# Altium schematic sheet Schematic.SchDoc
size A; SheetNumber: 1; SheetTotal: 1
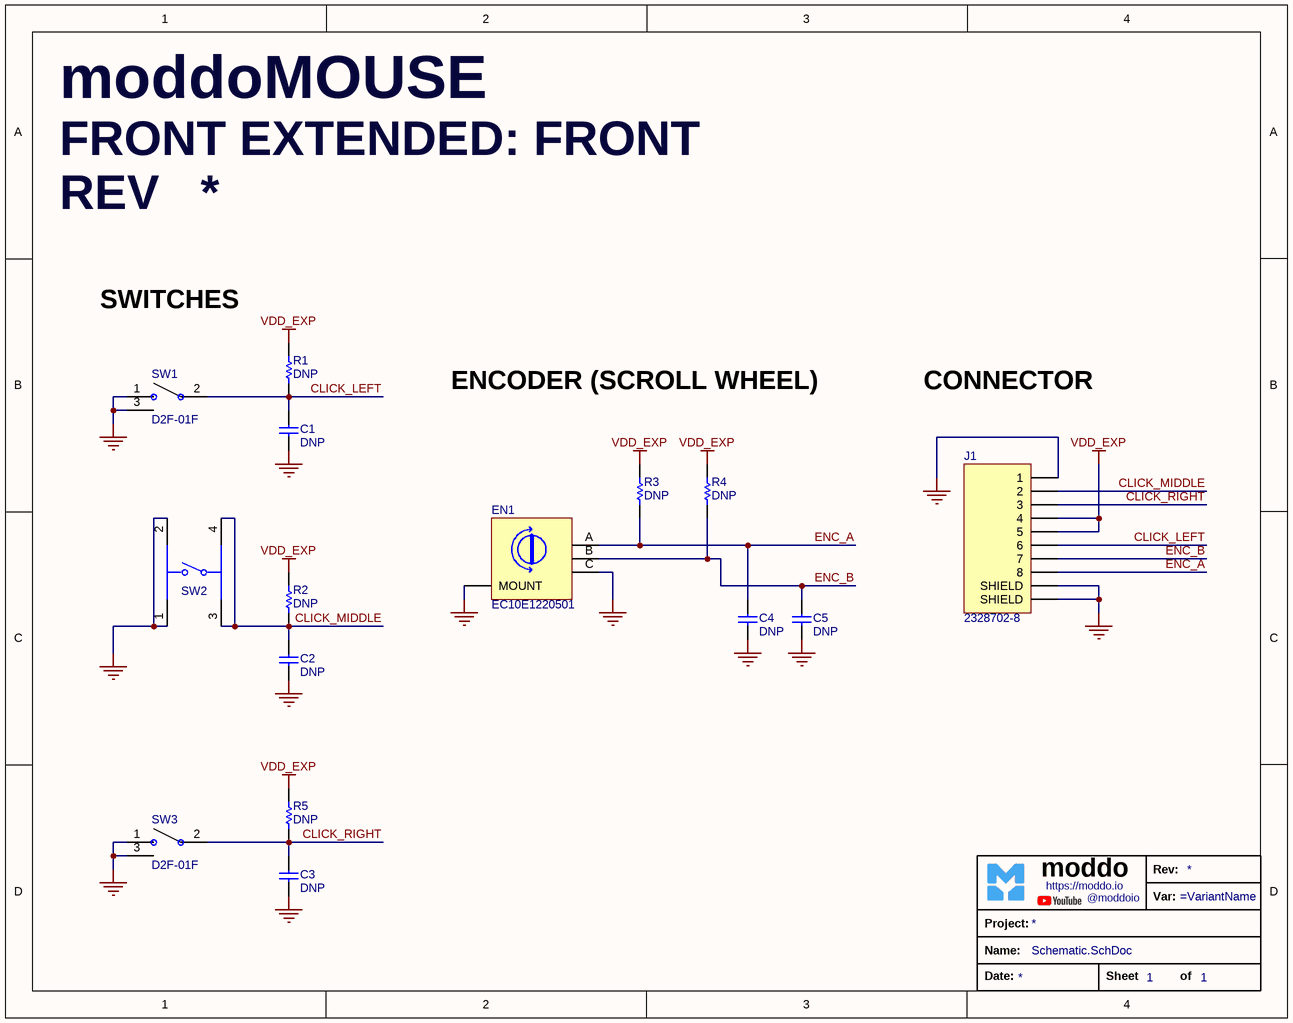
[diagram p0: Schematic.SchDoc]

## Parts
?  TitleBlock_moddo  (value not drawn)  (graphical)
C1  value DNP  [CAP0603]  (hidden comment: N/A)
C2  value DNP  [CAP0603]  (hidden comment: N/A)
C3  value DNP  [CAP0603]  (hidden comment: N/A)
C4  value DNP  [CAP0603]  (hidden comment: N/A)
C5  value DNP  [CAP0603]  (hidden comment: N/A)
EN1  EC10E1220501  [THROUGH_SHAFT_ENCODER_9MM]
J1  2328702-8  [2328702-8]
R1  value DNP  [RES0603]  (hidden comment: N/A)
R2  value DNP  [RES0603]  (hidden comment: N/A)
R3  value DNP  [RES0603]  (hidden comment: N/A)
R4  value DNP  [RES0603]  (hidden comment: N/A)
R5  value DNP  [RES0603]  (hidden comment: N/A)
SW1  D2F-01F  [Microswitch]
SW2  TS02-66-70-BK-100-SCR-D  [TS02-66-70-BK-100-SCR-D]  (value not drawn)
SW3  D2F-01F  [Microswitch]

## Nets
GND: C1.1 C2.1 C3.1 C4.1 C5.1 EN1.C EN1.MOUNT J1.1 J1.S1(SHIELD) J1.S2(SHIELD) SW1.1 SW1.3 SW2.1 SW2.2 SW3.1 SW3.3
VDD_EXP: J1.4 J1.5 R1.1 R2.1 R3.1 R4.1 R5.1
CLICK_LEFT: C1.2 J1.6 R1.2 SW1.2
CLICK_MIDDLE: C2.2 J1.2 R2.2 SW2.3 SW2.4
CLICK_RIGHT: C3.2 J1.3 R5.2 SW3.2
ENC_A: C4.2 EN1.A J1.8 R3.2
ENC_B: C5.2 EN1.B J1.7 R4.2

## Notes on the sheet
- moddoMOUSE
- FRONT EXTENDED: FRONT
- REV
- SWITCHES
- ENCODER (SCROLL WHEEL)
- CONNECTOR
- (in symbol TitleBlock_moddo) Rev:; moddo; https://moddo.io; Var:; @moddoio; Project:; Name:; Date:; Sheet; of

## Library data of the parts
C1-C5 = C0402-1µ0: Manufacturer: N/A; Manufacturer Part Number: N/A; RoHS: Yes; Category: Ceramic Capacitors; RoHS Compliant: Yes
EN1 = EC10E1220501: Mechanical Encoder Rotary Incremental Hollow 5mN.m Right Angle Quadrature Digital Square Wave 12PPR Through Hole PC Pin; Manufacturer: Alps Electric; Number of Channels: 2; Max Supply Voltage (DC): 5V; Pulses per Revolution: 12; Built in Switch: No; Hole Diameter: 1.8mm; Supplier 1: Newark; Manufacturer Part Number: EC10E1220501; RoHS: Yes; Category: Encoders; Stock 1: 3368; Pricing 1: 1=1.08, 10=0.867, 25=0.832, 50=0.798, 100=0.762 (USD); Mounting Technology: Through Hole; Pins: 3; Min Operating Temperature: -30°C; Max Operating Temperature: 85°C; Packaging: Bulk; Package Quantity: 1600; Termination: Through Hole; Radiation Hardening: No; Lead Free: Lead Free; RoHS Compliant: Yes; ComponentLink1URL: https://datasheet.ciiva.com/16205/ec10e-16205171.pdf?src-supplier=Onlinecomponents.com; ComponentLink1Description: https://datasheet.ciiva.com/16205/ec10e-16205171.pdf?src-supplier=Onlinecomponents.com; ComponentLink2URL: https://datasheet.ciiva.com/18154/getdatasheetpartid-652090-18154129.pdf?src-supplier=Verical; ComponentLink2Description: https://datasheet.ciiva.com/18154/getdatasheetpartid-652090-18154129.pdf?src-supplier=Verical; ComponentLink3URL: https://datasheet.ciiva.com/11807/0900766b80f4c220-11807983.pdf?src-supplier=Rs; ComponentLink3Description: https://datasheet.ciiva.com/11807/0900766b80f4c220-11807983.pdf?src-supplier=Rs; ComponentLink4URL: https://datasheet.ciiva.com/1310/1837000-1310536.pdf?src-supplier=Element14; ComponentLink4Description: https://datasheet.ciiva.com/1310/1837000-1310536.pdf?src-supplier=Element14
J1 = 2328702-8: FFC/FPC Connector, 8 Contact(s), 1 Row(s), Right Angle, Solder Terminal, Natural Insulator; Manufacturer: TE Connectivity; Actuator Material: Thermoplastic; Actuator Color: Black; Plating: Gold; Number of Positions: 8; Voltage Rating: 50V; Connector System: Wire-to-Board; Gender: Receptacle; Sealable: No (Without); Supplier 1: Arrow Electronics; Manufacturer Part Number: 2328702-8; RoHS: Yes; Category: FFC / FPC; Stock 1: 56000; Pricing 1: 28000=0.0961 (USD); Mounting Technology: Surface Mount; Contact Material: Copper Alloy; Contact Plating: Gold; Housing Material: Thermoplastic; Housing Color: Natural; Min Operating Temperature: -40°C; Max Operating Temperature: 85°C; Packaging: Cut Tape; Termination: Solder; Series: -; Number of Contacts: 8; Number of Rows: 1; Operating Supply Voltage: 50V; Orientation: Right Angle; Length: 6mm; Height: 1mm; Flammability Rating: UL94 V-0; ComponentLink1URL: https://www.te.com/commerce/DocumentDelivery/DDEController?Action=srchrtrv&amp;DocNm=2328702&amp;DocType=Customer+Drawing&amp;DocLang=English&src-supplier=Digikey; ComponentLink1Description: https://www.te.com/commerce/DocumentDelivery/DDEController?Action=srchrtrv&amp;DocNm=2328702&amp;DocType=Customer+Drawing&amp;DocLang=English&src-supplier=Digikey; Supplier Part Number 1: 2328702-8
R1-R5 = Res1: Manufacturer: N/A; Manufacturer Part Number: N/A
SW1 SW3 = Microswitch: SWITCH SNAP ACTION SPDT 0.1A 30V; Manufacturer: Omron Electronics Inc-EMC Div; Manufacturer Part Number: D2F-01F
SW2 = TS02-66-70-BK-100-SCR-D: Switch Tactile Spst-no 0.05A 12V; Manufacturer: Same Sky; Contact Resistance: 100mΩ; Electrical Life: 100kcycles; Max Current Rating: 50mA; Number of Positions: 1; Operating Force: 980mN; Throw Configuration: SPST; Supplier 1: DigiKey; Manufacturer Part Number: TS02-66-70-BK-100-SCR-D; RoHS: Compliant; Category: Tactile Switches; Stock 1: 2978; Pricing 1: 1=0.1, 10=0.093, 25=0.0872, 100=0.0788, 250=0.07328, 500=0.0692, 1000=0.06531, 3000=0.05961, 5000=0.0572 (USD); Color: Black; Contact Plating: Silver; Height: 3.5mm; Housing Material: Stainless Steel; Insulation Resistance: 100MΩ; Length: 6mm; Lifecycle Status: Production; Max Operating Temperature: 80°C; Max Voltage Rating (DC): 12V; Min Operating Temperature: -30°C; REACH SVHC: Yes; Terminal Material: Brass; ComponentLink1URL: https://datasheet.octopart.com:443/TS02-66-70-BK-100-SCR-D-Same-Sky-datasheet-183540777.pdf?src-supplier=Same+Sky; ComponentLink1Description: https://datasheet.octopart.com:443/TS02-66-70-BK-100-SCR-D-Same-Sky-datasheet-183540777.pdf?src-supplier=Same+Sky; ComponentLink2URL: https://datasheet.octopart.com:443/TS02-66-70-BK-100-SCR-D-Same-Sky-datasheet-181920466.pdf?src-supplier=Same+Sky; ComponentLink2Description: https://datasheet.octopart.com:443/TS02-66-70-BK-100-SCR-D-Same-Sky-datasheet-181920466.pdf?src-supplier=Same+Sky; ComponentLink3URL: https://datasheet.octopart.com:443/TS02-66-70-BK-100-SCR-D-Same-Sky-datasheet-181920465.pdf?src-supplier=Same+Sky; ComponentLink3Description: https://datasheet.octopart.com:443/TS02-66-70-BK-100-SCR-D-Same-Sky-datasheet-181920465.pdf?src-supplier=Same+Sky; ComponentLink4URL: https://datasheet.octopart.com:443/TS02-66-70-BK-100-SCR-D-CUI-Devices-datasheet-175928973.pdf?src-supplier=Same+Sky; ComponentLink4Description: https://datasheet.octopart.com:443/TS02-66-70-BK-100-SCR-D-CUI-Devices-datasheet-175928973.pdf?src-supplier=Same+Sky; ComponentLink5URL: https://datasheet.octopart.com:443/TS02-66-70-BK-100-SCR-D-CUI-Devices-datasheet-155929901.pdf?src-supplier=Same+Sky; ComponentLink5Description: https://datasheet.octopart.com:443/TS02-66-70-BK-100-SCR-D-CUI-Devices-datasheet-155929901.pdf?src-supplier=Same+Sky; ComponentLink6URL: https://datasheet.octopart.com:443/TS02-66-70-BK-100-SCR-D-CUI-Devices-datasheet-180438921.pdf?src-supplier=IHS; ComponentLink6Description: https://datasheet.octopart.com:443/TS02-66-70-BK-100-SCR-D-CUI-Devices-datasheet-180438921.pdf?src-supplier=IHS; ComponentLink7URL: https://datasheet.octopart.com:443/TS02-66-70-BK-100-SCR-D-Same-Sky-datasheet-182881588.pdf?src-supplier=Electro+Sonic; ComponentLink7Description: https://datasheet.octopart.com:443/TS02-66-70-BK-100-SCR-D-Same-Sky-datasheet-182881588.pdf?src-supplier=Electro+Sonic; ComponentLink8URL: https://datasheet.octopart.com:443/TS02-66-70-BK-100-SCR-D-Same-Sky-datasheet-189105763.pdf?src-supplier=Master+Electronics; ComponentLink8Description: https://datasheet.octopart.com:443/TS02-66-70-BK-100-SCR-D-Same-Sky-datasheet-189105763.pdf?src-supplier=Master+Electronics; ComponentLink9URL: https://datasheet.octopart.com:443/TS02-66-70-BK-100-SCR-D-Same-Sky-datasheet-188930957.pdf?src-supplier=TME; ComponentLink9Description: https://datasheet.octopart.com:443/TS02-66-70-BK-100-SCR-D-Same-Sky-datasheet-188930957.pdf?src-supplier=TME; ComponentLink10URL: https://octopart.com:443/opatz8j6/c1?t=HLP653kfKUnNyLRaY-FaFV0j9z0a6ljyJcAd0g2ioQ_AonTMmNTwU4IVPJnMdy9eIxVQzuuD2Zu3pf7N-gy-D9NxffwwpVrbegg9M7luCdtijzqw1HD8XYM8rr4LEKe8WthgaTICQcVnT4EdaXrmdMRbIv_syAbN7vWeLxd063wKgO5rufBQuoDPxsRiZXaF5zj2j9QuxBlB29jUVY_5bRBrvllIk-1OXrlBRrRDb8qAyP_q7sjIWfGfu8FS9OuYKaYi-jPcp7RsNayvVhYY7F0QXbvDBl27IGeqaU01JtaMs89zYB4bZG8DLFkocbUh-1087gIX4bVPJQCA7y3bbMeEPsiQw70TGyHqnWLUSeqz4Ubouw&src-supplier=Compliance+Statements; ComponentLink10Description: https://octopart.com:443/opatz8j6/c1?t=HLP653kfKUnNyLRaY-FaFV0j9z0a6ljyJcAd0g2ioQ_AonTMmNTwU4IVPJnMdy9eIxVQzuuD2Zu3pf7N-gy-D9NxffwwpVrbegg9M7luCdtijzqw1HD8XYM8rr4LEKe8WthgaTICQcVnT4EdaXrmdMRbIv_syAbN7vWeLxd063wKgO5rufBQuoDPxsRiZXaF5zj2j9QuxBlB29jUVY_5bRBrvllIk-1OXrlBRrRDb8qAyP_q7sjIWfGfu8FS9OuYKaYi-jPcp7RsNayvVhYY7F0QXbvDBl27IGeqaU01JtaMs89zYB4bZG8DLFkocbUh-1087gIX4bVPJQCA7y3bbMeEPsiQw70TGyHqnWLUSeqz4Ubouw&src-supplier=Compliance+Statements; ComponentLink11URL: https://octopart.com:443/opatz8j6/c1?t=70fxgALqLpNjG_K9rPovwjysU7jzIpdyzzOEfmqjcTOs-6ROmuQBhYmqs_ZuAcaqBIATg-po2KHNT8FFRDBRYIL0_klCBg093_lnv4m-VGCcxpH2tv7ZoDf42NqrFcaiS2p9v1HLMgL58Bvgkh7fWiFupQqqJcboTLtiFznQTeSRB_YWVsAUcqmYMh2aDwt2rP0HYapAehBpzXszozGpJmInMSOs89qtbfp5XPDIds3FFewjYOYywpW73NyliGrA4cmELQKKu9WCRcDeI_p_KBFSh0TkHYgoFAYL7Wsi2MddJKeTwre8sAVdxTEufmEfLTJTVqSle3Q2DFxEX0bFsJRtku0Ewjz7V8cehC3yuXL6NI5jn2H_FXM&src-supplier=Compliance+Statements; ComponentLink11Description: https://octopart.com:443/opatz8j6/c1?t=70fxgALqLpNjG_K9rPovwjysU7jzIpdyzzOEfmqjcTOs-6ROmuQBhYmqs_ZuAcaqBIATg-po2KHNT8FFRDBRYIL0_klCBg093_lnv4m-VGCcxpH2tv7ZoDf42NqrFcaiS2p9v1HLMgL58Bvgkh7fWiFupQqqJcboTLtiFznQTeSRB_YWVsAUcqmYMh2aDwt2rP0HYapAehBpzXszozGpJmInMSOs89qtbfp5XPDIds3FFewjYOYywpW73NyliGrA4cmELQKKu9WCRcDeI_p_KBFSh0TkHYgoFAYL7Wsi2MddJKeTwre8sAVdxTEufmEfLTJTVqSle3Q2DFxEX0bFsJRtku0Ewjz7V8cehC3yuXL6NI5jn2H_FXM&src-supplier=Compliance+Statements; ComponentLink12URL: https://octopart.com:443/opatz8j6/c1?t=0M2gUtPNxCIFKztzr0ORoQp74-qqkM508TPT7wg6m0fN_GA_OkfieEk8EIqSK9t5NbTvw4RdocQjUPrVJcY4NvfdBN--JLXOnsBa5bEMLNaIzwiYtbFg_6z_wR3zqnDTdSeF_oIuOYO8CYFrj75SMWMnab9KxghoES98oqWa6u9tO-Rmbu1W1tT6emVTSCYp7BgLb3OBYN-dQzTQZIBGhGfaphAjKsycwfMKwTeGkST-ilBj1Z_gxNVAgV-6yKJLuy_GAbFai0Kg7uavY94pLOpbiRI-h0GWb66rsUlTT5xwqO7ZyWRlLnQY9NYeXMFqEYDrJCNP-b1rzYCCJcH7sxmr3xVo_XKPUQ&src-supplier=Compliance+Statements; ComponentLink12Description: https://octopart.com:443/opatz8j6/c1?t=0M2gUtPNxCIFKztzr0ORoQp74-qqkM508TPT7wg6m0fN_GA_OkfieEk8EIqSK9t5NbTvw4RdocQjUPrVJcY4NvfdBN--JLXOnsBa5bEMLNaIzwiYtbFg_6z_wR3zqnDTdSeF_oIuOYO8CYFrj75SMWMnab9KxghoES98oqWa6u9tO-Rmbu1W1tT6emVTSCYp7BgLb3OBYN-dQzTQZIBGhGfaphAjKsycwfMKwTeGkST-ilBj1Z_gxNVAgV-6yKJLuy_GAbFai0Kg7uavY94pLOpbiRI-h0GWb66rsUlTT5xwqO7ZyWRlLnQY9NYeXMFqEYDrJCNP-b1rzYCCJcH7sxmr3xVo_XKPUQ&src-supplier=Compliance+Statements; ComponentLink13URL: https://octopart.com:443/opatz8j6/c1?t=diif9Q9lWxKVNFgYf2ypxkBIpJy_xgH8lB9SlF-sgjeEzbBCUVmT_nzSoRgXF36nPrchZjg3iSgBGugOu1kM5DFk3dZCPjGsZ2AECwKBw0yNVqZziTPdJApiVqJ2N8tp3yywOshnCqmZxG2i-lqiFfHMSfwXJbIAb0IWzMQMxGRWHhSJomd94oD279jFTGt8oizERBWbfb88NO9_Xr3EVZhRepn2f-WGygd1GS9heeHI2QHR3-nScg2II5lErYeUXOg5oJ91TW5jc1ptKnvIg9-7FjmYCEPJ7ClYA3CtivUmUoH3UgqEViyww75S0eqfJ7jiv1ohBfmjBBBnsjsMwfP_bN0qkEs5FUvu0_Goiq3pWEomZw&src-supplier=Compliance+Statements; ComponentLink13Description: https://octopart.com:443/opatz8j6/c1?t=diif9Q9lWxKVNFgYf2ypxkBIpJy_xgH8lB9SlF-sgjeEzbBCUVmT_nzSoRgXF36nPrchZjg3iSgBGugOu1kM5DFk3dZCPjGsZ2AECwKBw0yNVqZziTPdJApiVqJ2N8tp3yywOshnCqmZxG2i-lqiFfHMSfwXJbIAb0IWzMQMxGRWHhSJomd94oD279jFTGt8oizERBWbfb88NO9_Xr3EVZhRepn2f-WGygd1GS9heeHI2QHR3-nScg2II5lErYeUXOg5oJ91TW5jc1ptKnvIg9-7FjmYCEPJ7ClYA3CtivUmUoH3UgqEViyww75S0eqfJ7jiv1ohBfmjBBBnsjsMwfP_bN0qkEs5FUvu0_Goiq3pWEomZw&src-supplier=Compliance+Statements; ComponentLink14URL: https://octopart.com:443/opatz8j6/c1?t=imcCfIDy5o_ml50jtfjPxlR6DZ_wJD5zN0zQzufCnUTvUT0YJEIpXllkHao9xdejupS_czezSO7NHYOkFFzvO-KWfitz_4VyM9E57VLf2lJat0Li5JMhp_PVSZeq-2lKDWqSwTzEPRMj8I_f-Bcni8gKS6mmu2GnDZ8MMk2UfHI6ioBV2HvYNDzpuGAzvtKEZz1R2H6q5jLC2OKgZnoSEYJSrhZ-HoMyrn1bi6_ivQyBh6WR3Osn0n3mf6szmji0OW0cS32L0RTDLzbe5apsoDXB1RAJOqIijn7fzRHDOhWtDUqiBOOdw2DWMA6LC7TFGd2P5An41jYudu2603zI8PWHVSPGioqRMTziF1Fy9Kg1Zw3IXdiPQyQ&src-supplier=Compliance+Statements; ComponentLink14Description: https://octopart.com:443/opatz8j6/c1?t=imcCfIDy5o_ml50jtfjPxlR6DZ_wJD5zN0zQzufCnUTvUT0YJEIpXllkHao9xdejupS_czezSO7NHYOkFFzvO-KWfitz_4VyM9E57VLf2lJat0Li5JMhp_PVSZeq-2lKDWqSwTzEPRMj8I_f-Bcni8gKS6mmu2GnDZ8MMk2UfHI6ioBV2HvYNDzpuGAzvtKEZz1R2H6q5jLC2OKgZnoSEYJSrhZ-HoMyrn1bi6_ivQyBh6WR3Osn0n3mf6szmji0OW0cS32L0RTDLzbe5apsoDXB1RAJOqIijn7fzRHDOhWtDUqiBOOdw2DWMA6LC7TFGd2P5An41jYudu2603zI8PWHVSPGioqRMTziF1Fy9Kg1Zw3IXdiPQyQ&src-supplier=Compliance+Statements; ComponentLink15URL: https://octopart.com:443/opatz8j6/c1?t=kKijr8Z3YtJHTTjWnXb3xh0DJP5EzxeX4UFkx4TEZ6Cz0Z832s2bRldFgYZlCpaXiK9LCmfdBkdCa6SQTrNfeR21pT66xN4z56ytO83LXIFW6jqhfe0BF4PCg9LZ01M04qLlAqJjGu9g9SeA4zCDxwvuczhHHSMbXOPUkjBKcuT-covQ3TDYxKJX1WQbLINFlqNmhVdmt0nNVmCHYY5UlYZquJcZxWugtPfk0hXKeUZrRbCaVG2WVxMsTTDZa3ihWnkhx37ifFF9Olm0_Nb0GN6vgv_2MEW77TYbpXRH10yY7gT6N9FBAuGfJTCPb3AxGTSm9otgR3_KqACkaD-fKVuVVtpYMw7tLA&src-supplier=Compliance+Statements; ComponentLink15Description: https://octopart.com:443/opatz8j6/c1?t=kKijr8Z3YtJHTTjWnXb3xh0DJP5EzxeX4UFkx4TEZ6Cz0Z832s2bRldFgYZlCpaXiK9LCmfdBkdCa6SQTrNfeR21pT66xN4z56ytO83LXIFW6jqhfe0BF4PCg9LZ01M04qLlAqJjGu9g9SeA4zCDxwvuczhHHSMbXOPUkjBKcuT-covQ3TDYxKJX1WQbLINFlqNmhVdmt0nNVmCHYY5UlYZquJcZxWugtPfk0hXKeUZrRbCaVG2WVxMsTTDZa3ihWnkhx37ifFF9Olm0_Nb0GN6vgv_2MEW77TYbpXRH10yY7gT6N9FBAuGfJTCPb3AxGTSm9otgR3_KqACkaD-fKVuVVtpYMw7tLA&src-supplier=Compliance+Statements; Supplier Part Number 1: 2223-TS02-66-70-BK-100-SCR-D-ND